# Altium schematic sheet 同向2倍放大.SchDoc
size A4
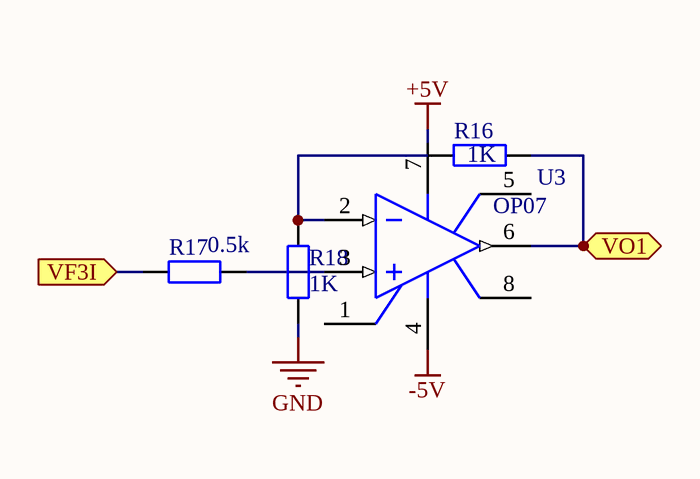
[diagram p0: 同向2倍放大.SchDoc]

## Parts
R16  value 1K  [AXIAL-0.4]  (hidden comment: Res2)
R17  value 0.5k  [AXIAL-0.4]  (hidden comment: Res2)
R18  value 1K  [AXIAL-0.4]  (hidden comment: Res2)
U3  OP07  [N-8_A]

## Ports
VF3I (in), VO1 (out)

## Nets
+5V: U3.7(V+)
-5V: U3.4(V-)
GND: R18.1
VF3I: R17.1 ; port VF3I
VO1: R16.2 U3.6(OUT) ; port VO1
NetR16_1: R16.1 R18.2 U3.2(IN-)
NetR17_2: R17.2 U3.3(IN+)

Not connected (* = marked no-connect by the designer): U3 1(NULL1) 5(NC) 8(NULL2)

## Notes on the sheet
- 标题
- 日期
- 红外数字模拟接收一体机
- 2015 5 29
- 作者
- 模电组
- 单位
- 电子技术协会

## Library data of the parts
R16-R18 = Res2: Resistor; Published: 8-Jun-2000; LatestRevisionDate: 17-Jul-2002; LatestRevisionNote: Re-released for DXP Platform.; PackageReference: AXIAL-0.4; Publisher: Altium Limited
U3 = ADOP07CN: Ultra-Low Offset Voltage Operational Amplifier; Note: Pin 5 is not connected.; Published: 8-Jun-2000; LatestRevisionDate: 04-Mar-2005; LatestRevisionNote: Stylized 3D Model Added.; DatasheetVersion: 1992; PackageReference: N-8_A; Publisher: Altium Limited; PackageDescription: DIP; 8 Leads; Row Spacing 7.62 mm; Pitch 2.54 mm; Code_JEDEC: MO-001-AN; ComponentLink1Description: Manufacturer Link; ComponentLink1URL: http://www.analog.com/